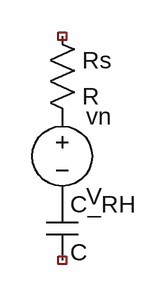
[diagram p0: schematic Draft1.asc]
Draft1.asc, the LTspice schematic file:
Version 4
SHEET 1 880 680
SYMBOL voltage 208 96 R0
SYMATTR InstName vn
SYMBOL res 192 16 R0
SYMATTR InstName Rs
SYMBOL cap 192 192 R0
SYMATTR InstName C_RH

The netlist it stands for:
* Draft1.asc
vn P001 P002 V
Rs NC_01 P001 R
C_RH P002 NC_02 C
.backanno
.end